# Altium schematic sheet POWER_SUPPLY_1.SchDoc: Power Supply
size A3; DocumentNumber: 8; SheetNumber: 8; SheetTotal: 12
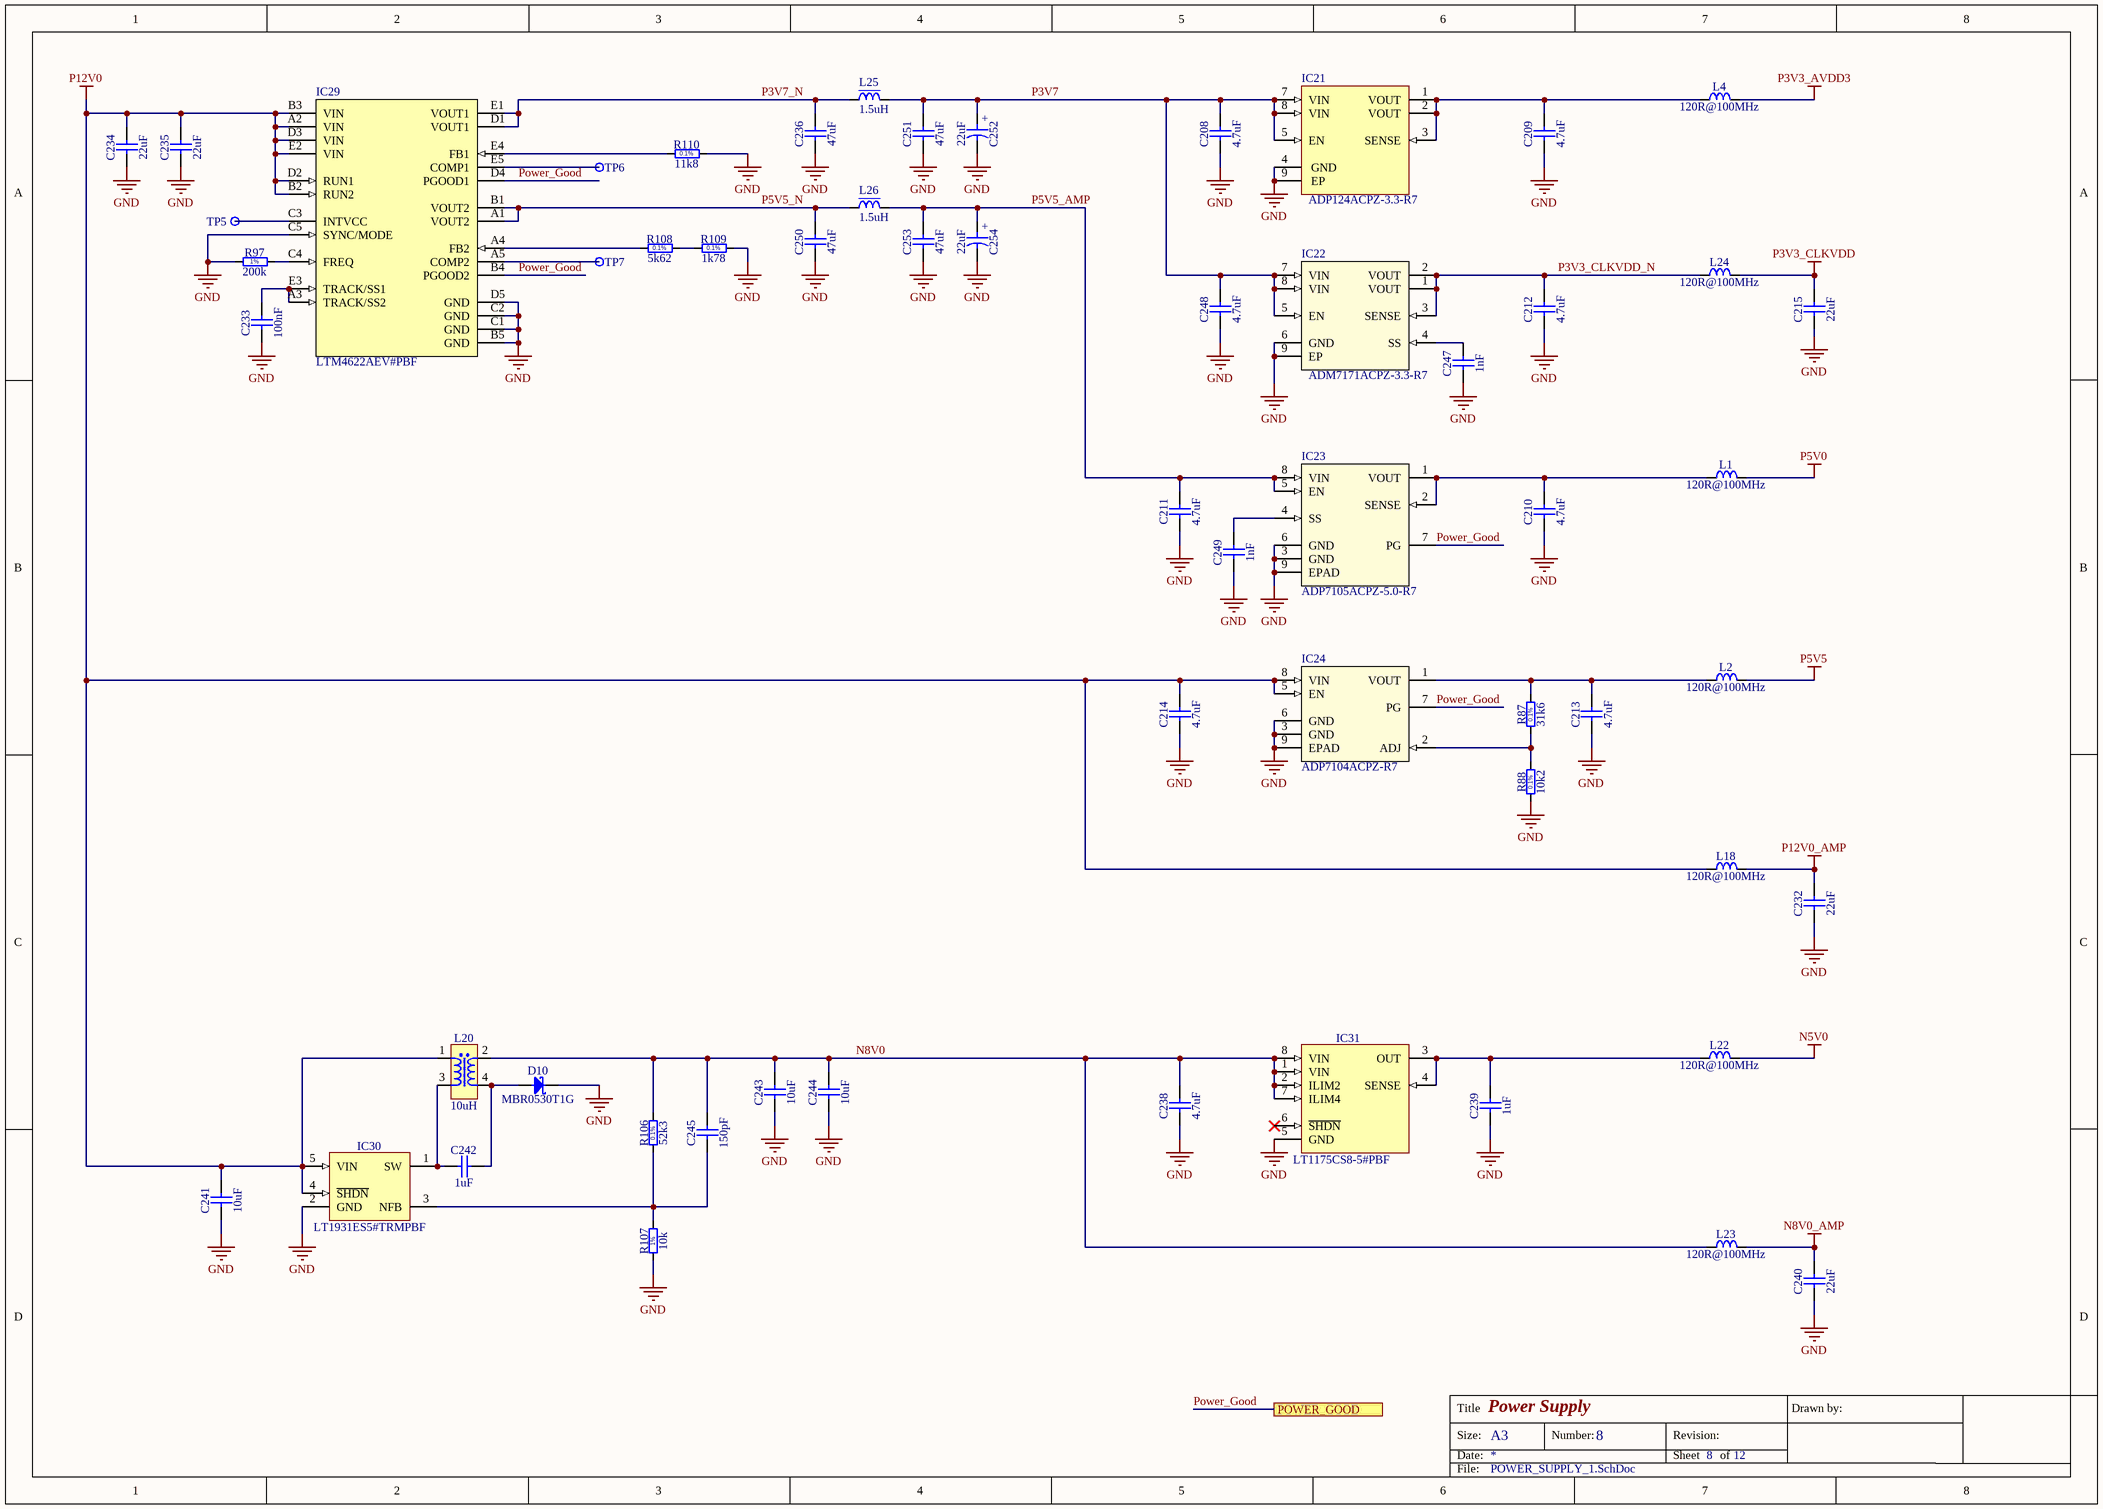
[diagram p0: POWER_SUPPLY_1.SchDoc]

## Parts
C208  4.7uF  [CAPC1709X95N]
C209  4.7uF  [CAPC1709X95N]
C210  4.7uF  [CAPC1709X95N]
C211  4.7uF  [CAPC1709X95N]
C212  4.7uF  [CAPC1709X95N]
C213  4.7uF  [CAPC1709X95N]
C214  4.7uF  [CAPC1709X95N]
C215  22uF  [CAPC1709X100N]
C232  22uF  [CAPC1709X100N]
C233  100nF  [CAPC1005X55N]
C234  22uF  [CAPC2012X135N]
C235  22uF  [CAPC2012X135N]
C236  47uF  [CAPC3225X270N]
C238  4.7uF  [CAPC1709X95N]
C239  1uF  [CAPC1608X87N]
C240  22uF  [CAPC1709X100N]
C241  10uF  [CAPC2012X135N]
C242  1uF  [CAPC1608X87N]
C243  10uF  [CAPC2012X135N]
C244  10uF  [CAPC2012X135N]
C245  150pF  [CAPC1005X55N]
C247  1nF  [CAPC0603X33N]
C248  4.7uF  [CAPC1709X95N]
C249  1nF  [CAPC0603X33N]
C250  47uF  [CAPC3225X270N]
C251  47uF  [CAPC3225X270N]
C252  22uF  [CAPMP3528X210N]
C253  47uF  [CAPC3225X270N]
C254  22uF  [CAPMP3528X210N]
D10  MBR0530T1G  [SOD3715X145N]
IC21  ADP124ACPZ-3.3-R7  [CP_8_8-L]
IC22  ADM7171ACPZ-3.3-R7  [CP_8_21-L]
IC23  ADP7105ACPZ-5.0-R7  [CP_8_5]
IC24  ADP7104ACPZ-R7  [CP_8_5]
IC29  LTM4622AEV#PBF  [LGA25C127P5X5_625X625X182]
IC30  LT1931ES5#TRMPBF  [SOT95P280X100-5N]
IC31  LT1175CS8-5#PBF  [SOIC127P600X175-8N]
L1  120R@100MHz  [INDC1608X65N]
L2  120R@100MHz  [INDC1608X65N]
L4  120R@100MHz  [INDC1608X65N]
L18  120R@100MHz  [INDC1608X65N]
L20  10uH  [IND_BOURNS_SRF0703]
L22  120R@100MHz  [INDC1608X65N]
L23  120R@100MHz  [INDC1608X65N]
L24  120R@100MHz  [INDC1608X65N]
L25  1.5uH  [IND_SPM4020]
L26  1.5uH  [IND_SPM4020]
R87  31k6  [RESC1608X55N]
R88  10k2  [RESC1608X55N]
R97  200k  [RESC1005X40N]
R106  52k3  [RESC1608X55N]
R107  10k  [RESC1608X55N]
R108  5k62  [RESC1608X55N]
R109  1k78  [RESC1608X55N]
R110  11k8  [RESC1608X55N]
TP5  Test Point  [TPS62]  (value not drawn)
TP6  Test Point  [TPS62]  (value not drawn)
TP7  Test Point  [TPS62]  (value not drawn)

## Ports
POWER_GOOD

## Nets
GND: C208.1 C209.1 C210.1 C211.1 C212.1 C213.1 C214.1 C215.1 C232.1 C233.1 C234.1 C235.1 C236.1 C238.1 C239.1 C240.1 C241.1 C243.1 C244.1 C247.1 C248.1 C249.1 C250.1 C251.1 C252.2 C253.1 C254.2 D10.1(C) IC21.4(GND) IC21.9(EP) IC22.6(GND) IC22.9(EP) IC23.3(GND) IC23.6(GND) IC23.9(EPAD) IC24.3(GND) IC24.6(GND) IC24.9(EPAD) IC29.B5(GND) IC29.C1(GND) IC29.C2(GND) IC29.C5(SYNC/MODE) IC29.D5(GND) IC30.2(GND) IC31.5(GND) R88.1 R97.1 R107.1 R109.2 R110.2
N5V0: L22.2
N8V0_AMP: C240.2 L23.2
P3V3_AVDD3: L4.2
P3V3_CLKVDD: C215.2 L24.2
P5V0: L1.2
P5V5: L2.2
P12V0: C214.2 C234.2 C235.2 C241.2 IC24.5(EN) IC24.8(VIN) IC29.A2(VIN) IC29.B2(RUN2) IC29.B3(VIN) IC29.D2(RUN1) IC29.D3(VIN) IC29.E2(VIN) IC30.4(~{SHDN}) IC30.5(VIN) L18.1 L20.1
P12V0_AMP: C232.2 L18.2
N8V0: C238.2 C243.2 C244.2 C245.2 IC31.1(VIN) IC31.2(ILIM2) IC31.7(ILIM4) IC31.8(VIN) L20.2 L23.1 R106.2
P3V3_CLKVDD_N: C212.2 IC22.1(VOUT) IC22.2(VOUT) IC22.3(SENSE) L24.1
P3V7: C208.2 C248.2 C251.2 C252.1 IC21.5(EN) IC21.7(VIN) IC21.8(VIN) IC22.5(EN) IC22.7(VIN) IC22.8(VIN) L25.2
P3V7_N: C236.2 IC29.D1(VOUT1) IC29.E1(VOUT1) L25.1
P5V5_AMP: C211.2 C253.2 C254.1 IC23.5(EN) IC23.8(VIN) L26.2
P5V5_N: C250.2 IC29.A1(VOUT2) IC29.B1(VOUT2) L26.1
Power_Good: IC23.7(PG) IC24.7(PG) IC29.B4(PGOOD2) IC29.D4(PGOOD1) ; port POWER_GOOD
NetC209_2: C209.2 IC21.1(VOUT) IC21.2(VOUT) IC21.3(SENSE) L4.1
NetC210_2: C210.2 IC23.1(VOUT) IC23.2(SENSE) L1.1
NetC213_2: C213.2 IC24.1(VOUT) L2.1 R87.2
NetC233_2: C233.2 IC29.A3(TRACK/SS2) IC29.E3(TRACK/SS1)
NetC239_2: C239.2 IC31.3(OUT) IC31.4(SENSE) L22.1
NetC242_1: C242.1 IC30.1(SW) L20.3
NetC242_2: C242.2 D10.2(A) L20.4
NetC245_1: C245.1 IC30.3(NFB) R106.1 R107.2
NetC247_2: C247.2 IC22.4(SS)
NetC249_2: C249.2 IC23.4(SS)
NetIC24_2: IC24.2(ADJ) R87.1 R88.2
NetIC29_A4: IC29.A4(FB2) R108.1
NetIC29_A5: IC29.A5(COMP2) TP7.1
NetIC29_C3: IC29.C3(INTVCC) TP5.1
NetIC29_C4: IC29.C4(FREQ) R97.2
NetIC29_E4: IC29.E4(FB1) R110.1
NetIC29_E5: IC29.E5(COMP1) TP6.1
NetR108_2: R108.2 R109.1

Not connected (* = marked no-connect by the designer): IC21 6(NC); IC24 4(NC); IC31 6(~{SHDN})*

## Notes on the sheet
- Title
- Size:
- Date:
- A3
- Number:
- Revision:
- Sheet
- of
- Drawn by:
- File:
- (in symbol CTE3528-21_22UF_10V_10%_LESR0700) +
- (in symbol R0402_200K_1%_0.0625W_100PPM) 1%
- (in symbol R0603_1K78_0.1%_0.063W_10PPM) 0.1%
- (in symbol R0603_5K62_0.1%_0.063W_10PPM) 0.1%
- (in symbol R0603_10K2_0.1%_0.063W_10PPM) 0.1%
- (in symbol R0603_10K_1%_0.1W_100PPM) 1%
- (in symbol R0603_11K8_0.1%_0.063W_10PPM) 0.1%
- (in symbol R0603_31K6_0.1%_0.063W_10PPM) 0.1%
- (in symbol R0603_52K3_0.1%_0.063W_10PPM) 0.1%

## Library data of the parts
C208-C214 C238 C248 = CC0603_4.7UF_16V_10%_X5R: Non-polarised capacitor; Part Description: SMD Multilayer Chip Ceramic Capacitor; Manufacturer: GENERIC; Manufacturer1 Part Number: EMK107ABJ475KA-T; Voltage: 16V; TC: X5R; Tolerance: ±10%; Part Number: CC0603_4.7UF_16V_10%_X5R; Component Kind: Standard; Component Type: Standard; Pin Count: 2; Value: 4.7uF; Status: None; Manufacturer Part Number: CC0603_4.7UF_16V_10%_X5R; Case: 0603; Mounted: Yes; Socket: No; SMD: Yes; Sense: No; Manufacturer1 Example: TAIYO YUDEN; Manufacturer1 ComponentHeight: 0.95mm; HelpURL: \\cern.ch\dfs\Applications\Altium\Datasheets\CC0603_X7R_TAIYO-YUDEN_HIGH-VALUE.pdf; Author: CERN DEM JLC; CreateDate: 16.12.2013; LatestRevisionDate: 16.09.2014
C215 C232 C240 = CC0603_22UF_6.3V_20%_X5R: Non-polarised capacitor; Part Description: SMD Multilayer Chip Ceramic Capacitor; Manufacturer: GENERIC; Manufacturer1 Part Number: C1608X5R0J226M080AC; Voltage: 6.3V; TC: X5R; Tolerance: ±20%; Part Number: CC0603_22UF_6.3V_20%_X5R; Component Kind: Standard; Component Type: Standard; Pin Count: 2; Value: 22uF; Status: None; Manufacturer Part Number: CC0603_22UF_6.3V_20%_X5R; Case: 0603; Mounted: Yes; Socket: No; SMD: Yes; Sense: No; Manufacturer1 Example: TDK; Manufacturer1 ComponentHeight: 1mm; HelpURL: \\cern.ch\dfs\Applications\Altium\Datasheets\CC0603_X5R_TDK_C.pdf; Author: CERN DEM JLC; CreateDate: 16.12.2013; LatestRevisionDate: 13.09.2016
C233 = CC0402_100NF_16V_10%_X5R: Non-polarised capacitor; Part Description: SMD Multilayer Chip Ceramic Capacitor; Manufacturer: GENERIC; Manufacturer1 Part Number: GRM155R61C104KA88D; Voltage: 16V; TC: X5R; Tolerance: ±10%; Part Number: CC0402_100NF_16V_10%_X5R; Component Kind: Standard; Component Type: Standard; Pin Count: 2; Value: 100nF; Status: None; Manufacturer Part Number: CC0402_100NF_16V_10%_X5R; Case: 0402; Mounted: Yes; Socket: No; SMD: Yes; Sense: No; Manufacturer1 Example: MURATA; Manufacturer1 ComponentHeight: 0.55mm; HelpURL: \\cern.ch\dfs\Applications\Altium\Datasheets\CC0402_X5R_MURATA_GRM.pdf; Author: CERN DEM JLC; CreateDate: 10.12.2013; LatestRevisionDate: 10.12.2013
C234 C235 = CC0805_22UF_16V_10%_X5R: Non-polarised capacitor; Part Description: SMD Multilayer Chip Ceramic Capacitor; Manufacturer: GENERIC; Manufacturer1 Part Number: C2012X5R1C226KT; Voltage: 16V; TC: X5R; Tolerance: ±10%; Part Number: CC0805_22UF_16V_10%_X5R; Component Kind: Standard; Component Type: Standard; Pin Count: 2; Value: 22uF; Status: Preferred; Manufacturer Part Number: CC0805_22UF_16V_10%_X5R; Case: 0805; Mounted: Yes; Socket: No; SMD: Yes; Sense: No; Manufacturer1 Example: TDK; Manufacturer1 ComponentHeight: 1.35mm; HelpURL: \\cern.ch\dfs\Applications\Altium\Datasheets\CC0805_X5R_TDK_C.pdf; Author: CERN DEM JLC; CreateDate: 25.10.2012; LatestRevisionDate: 25.10.2012
C236 C250 C251 C253 = CC1210_47UF_10V_20%_X5R: Non-polarised capacitor; Part Description: SMD Multilayer Chip Ceramic Capacitor; Manufacturer: GENERIC; Manufacturer1 Part Number: LMK325BJ476MM-T; Voltage: 10V; TC: X5R; Tolerance: ±20%; Part Number: CC1210_47UF_10V_20%_X5R; Component Kind: Standard; Component Type: Standard; Pin Count: 2; Value: 47uF; Status: None; Manufacturer Part Number: CC1210_47UF_10V_20%_X5R; Case: 1210; Mounted: Yes; Socket: No; SMD: Yes; Sense: No; Manufacturer1 Example: TAIYO YUDEN; Manufacturer1 ComponentHeight: 2.7mm; HelpURL: \\cern.ch\dfs\Applications\Altium\Datasheets\CC1210_X5R_TAIYO-YUDEN_HIGH-VALUE.pdf; Author: CERN DEM JLC; CreateDate: 04.05.2011; LatestRevisionDate: 04.05.2011
C239 = CC0603_1UF_16V_10%_X7R: Non-polarised capacitor; Part Description: SMD Multilayer Chip Ceramic Capacitor; Manufacturer: GENERIC; Manufacturer1 Part Number: 223878615663; Voltage: 16V; TC: X7R; Tolerance: ±10%; Part Number: CC0603_1UF_16V_10%_X7R; Component Kind: Standard; Component Type: Standard; Pin Count: 2; Value: 1uF; Status: None; Manufacturer Part Number: CC0603_1uF_16V_10%_X7R; Case: 0603; Mounted: Yes; Socket: No; SMD: Yes; Sense: No; Manufacturer1 Example: YAGEO PHYCOMP; Manufacturer1 ComponentHeight: 0.9mm; HelpURL: \\cern.ch\dfs\Applications\Altium\Datasheets\CC0603_X7R_PHYCOMP.pdf; Author: CERN DEM JLC; CreateDate: 03.12.2007; LatestRevisionDate: 17.04.2015
C241 C243 C244 = CC0805_10UF_16V_10%_X5R: Non-polarised capacitor; Part Description: SMD Multilayer Chip Ceramic Capacitor; Manufacturer: GENERIC; Manufacturer1 Part Number: C0805C106K4PAC; Voltage: 16V; TC: X5R; Tolerance: ±10%; Part Number: CC0805_10UF_16V_10%_X5R; Component Kind: Standard; Component Type: Standard; Pin Count: 2; Value: 10uF; Status: Preferred; Manufacturer Part Number: CC0805_10UF_16V_10%_X5R; Case: 0805; Mounted: Yes; Socket: No; SMD: Yes; Sense: No; Manufacturer1 Example: KEMET; Manufacturer1 ComponentHeight: 1.4mm; HelpURL: \\cern.ch\dfs\Applications\Altium\Datasheets\CC1206_X5R_KEMET.pdf; Author: CERN DEM JLC; CreateDate: 03.12.2007; LatestRevisionDate: 03.12.2007
C242 = CC0603_1UF_25V_10%_X7R: Non-polarised capacitor; Part Description: SMD Multilayer Chip Ceramic Capacitor; Manufacturer: GENERIC; Manufacturer1 Part Number: GRM188R71E105KA12D; Voltage: 25V; TC: X7R; Tolerance: ±10%; Part Number: CC0603_1UF_25V_10%_X7R; Component Kind: Standard; Component Type: Standard; Pin Count: 2; Value: 1uF; Status: None; Manufacturer Part Number: CC0603_1UF_25V_10%_X7R; Case: 0603; Mounted: Yes; Socket: No; SMD: Yes; Sense: No; Manufacturer1 Example: MURATA; Manufacturer1 ComponentHeight: 0.9mm; HelpURL: \\cern.ch\dfs\Applications\Altium\Datasheets\CC0603_X7R_MURATA.pdf; Author: CERN DEM JLC; CreateDate: 18.01.2011; LatestRevisionDate: 18.01.2011
C245 = CC0402_150PF_50V_5%_C0G: Non-polarised capacitor; Part Description: SMD Multilayer Chip Ceramic Capacitor; Manufacturer: GENERIC; Manufacturer1 Part Number: C0402C151J5GACTU; Voltage: 50V; TC: C0G/NP0; Tolerance: ±5%; Part Number: CC0402_150PF_50V_5%_C0G; Component Kind: Standard; Component Type: Standard; Pin Count: 2; Value: 150pF; Status: Preferred; Manufacturer Part Number: CC0402_150PF_50V_5%_C0G; Case: 0402; Mounted: Yes; Socket: No; SMD: Yes; Sense: No; Manufacturer1 Example: KEMET; Manufacturer1 ComponentHeight: 0.55mm; HelpURL: \\cern.ch\dfs\Applications\Altium\Datasheets\CC0805_C0G_KEMET_(Commercial Grade).pdf; Author: CERN DEM JLC; CreateDate: 03.12.2007; LatestRevisionDate: 22.04.2015
C247 C249 = CC0201_1NF_16V_10%_X5R: Non-polarised capacitor; Part Description: SMD Multilayer Chip Ceramic Capacitor; Manufacturer: GENERIC; Manufacturer1 Part Number: 0201YD102KAT2A; Voltage: 16V; TC: X5R; Tolerance: ±10%; Part Number: CC0201_1NF_16V_10%_X5R; Component Kind: Standard; Component Type: Standard; Pin Count: 2; Value: 1nF; Status: Not Recommended; Manufacturer Part Number: CC0201_1NF_16V_10%_X5R; Case: 0201; Mounted: Yes; Socket: No; SMD: Yes; Sense: No; Manufacturer1 Example: AVX; Manufacturer1 ComponentHeight: 0.33mm; HelpURL: \\cern.ch\dfs\Applications\Altium\Datasheets\CC0201_X5R_AVX.pdf; Author: CERN DEM JLC; CreateDate: 03.12.2007; LatestRevisionDate: 03.12.2007
C252 C254 = CTE3528-21_22UF_10V_10%_LESR0700: Polarised capacitor; Part Description: Low ESR 0R7 Solid Tantalum Chip Capacitor; Manufacturer: GENERIC; Manufacturer1 Part Number: TPSB226K010R0700; Voltage: 10V; Tolerance: ±10%; Part Number: CTE3528-21_22UF_10V_10%_LESR0700; Component Kind: Standard; Component Type: Standard; Pin Count: 2; Value: 22uF; Status: Preferred; Manufacturer Part Number: CTE3528-21_22UF_10V_10%_LESR0700; Case: B; Mounted: Yes; Socket: No; SMD: Yes; Sense: No; Manufacturer1 Example: AVX; Manufacturer1 ComponentHeight: 2.1mm; HelpURL: \\cern.ch\dfs\Applications\Altium\Datasheets\CTE-LESR_AVX_TPS.pdf; Author: CERN DEM JLC; CreateDate: 05.05.2008; LatestRevisionDate: 20.01.2009
D10 = MBR0530T1G: Schottky Diode; Part Description: Schottky Power Rectifier; Manufacturer: ON SEMICONDUCTOR; Voltage: 30V; Power: 500mA; PressFit: No; Bonding: No; Part Number: MBR0530T1G; Component Kind: Standard; Component Type: Standard; Device: MBR0530T1G; PackageDescription: SOD Diode (SOD-123); 2.70mm W X 1.55mm L X 1.45mm H body, IPC Medium Density; Manufacturer Part Number: MBR0530T1G; Pin Count: 2; Case: SOD-123; Mounted: Yes; Socket: No; SMD: Yes; Sense: No; ComponentHeight: 1.45mm; HelpURL: \\cern.ch\dfs\Applications\Altium\Datasheets\MBR0530T1G.pdf; Author: CERN DEM JLC; CreateDate: 21.07.2010; LatestRevisionDate: 21.07.2010
IC21 = ADP124ACPZ-3.3-R7: 500 mA, Low Quiescent Current, CMOS Linear Regulator, 2.3 to 5.5 V Vin, 3.3 V Vout, Industrial, 8-pin SON (CP-8-8), Reel; Manufacturer: Analog Devices; Iout max: 500mA; Preset Vout Values (V): 3.3; Supply Current IGND @ Small Load: 45uA; Vin (min) (V): 2.3; Vin (max) (V): 5.5; Mounting Technology: Surface Mount; ComponentLink3URL: http:/www.analog.com/static/imported-files/packages/PKG_PDF/LFCSP(CP)/CP_8_8.pdf; ComponentLink1Description: Manufacturer URL; ComponentLink2Description: Datasheet; ComponentLink4URL: Product URL:http://www.analog.com/en/ADP124/productSearch.html; ComponentLink1URL: http://www.analog.com/en/index.html; PackageReference: CP-8-8; ComponentLink2URL: http://www.analog.com/static/imported-files/data_sheets/ADP124_125.pdf; ComponentLink4Description: URL Link1; PackageDescription: 8-Pin Lead Frame Chip Scale Package, Body 2 x 2 mm, Pitch 0.5 mm; ComponentLink3Description: Package Specification; Manufacturer Part Number: ADP124ACPZ-3.3-R7
IC22 = ADM7171ACPZ-3.3-R7: 6.5 V, 1 A, Ultralow Noise, High PSRR,  Fast Transient Response CMOS LDO; Manufacturer: Analog Devices; Value: Value; Type: Type; Manufacturer Part Number: ADM7171ACPZ-3.3-R7
IC23 = ADP7105ACPZ-5.0-R7: 20 V, 500 mA, Low Noise LDO Regulator  with Soft Start; Manufacturer: Analog Devices; Value: Value; Type: Type; Manufacturer Part Number: ADP7105ACPZ-5.0-R7
IC24 = ADP7104ACPZ-R7: 20 V, 500 mA, Low Noise CMOS LDO; Manufacturer: Analog Devices; Value: Value; Type: Type; Manufacturer Part Number: ADP7104ACPZ-R7
IC29 = LTM4622IV#PBF: Dual Ultrathin 2A or Single 4A, 3.6V to 20V, 1.5V to 12V   Step-Down DC/DC µModule Regulator; Manufacturer: LINEAR TECHNOLOGY; Manufacturer Part Number: LTM4622AEV#PBF
IC30 = LT1931ES5#TRMPBF: 1.2MHz/2.2MHz Inverting DC/DC Converters in ThinSOT; Part Description: +16V to (-0.4V to -36V), 1.2MHz Inverting DC-DC Converters; Manufacturer: LINEAR TECHNOLOGY; PressFit: No; Bonding: No; Part Number: LT1931ES5#TRMPBF; Component Kind: Standard; Component Type: Standard; Device: LT1931ES5#TRMPBF; PackageDescription: SOT23, 0.95mm pitch; 5 pin, 1.6mm W X 2.9mm L, IPC Medium Density; Manufacturer Part Number: LT1931ES5#TRMPBF; Pin Count: 5; Case: SOT23; Mounted: Yes; Socket: No; SMD: Yes; Sense: No; ComponentHeight: 1mm; HelpURL: \\cern.ch\dfs\Applications\Altium\Datasheets\LT1931ES5#TRMPBF.pdf; Author: CERN DEM JLC; CreateDate: 18.01.2010; LatestRevisionDate: 18.04.2012
IC31 = LT1175CS8#PBF: 5V 500mA Negative Low Dropout Micropower Regulator; Manufacturer: LINEAR TECHNOLOGY; Table: Regulators; Part Number: LT1175CS8#PBF; Component Kind: Standard; Component Type: Standard; Device: LT1175CS8-5#PBF; PackageDescription: SOIC 8, Pitch 1.27mm - Body 4x5mm, IPC Medium Density; Part Description: 5V 500mA Negative Low Dropout Micropower Regulator; Manufacturer Part Number: LT1175CS8-5#PBF; Pin Count: 8; Case: SOIC8; Mounted: Yes; Socket: No; SMD: Yes; ComponentHeight: 1.75mm; HelpURL: \\cern.ch\dfs\Applications\Altium\Datasheets\LT1175CS8#PBF.pdf; Author: CERN DEM JLC; CreateDate: 18.01.2010; LatestRevisionDate: 18.01.2010
L1 L2 L4 L18 L22-L24 = IND0603_MURATA_BLM18SG121TN1D: Inductor; Part Description: SMD EMIFIL Suppression Chip Ferrite Bead; Manufacturer: MURATA; Power: 3A; Resistance: 0.025R; Tolerance: ±25%; Part Number: IND0603_MURATA_BLM18SG121TN1D; Component Kind: Standard; Component Type: Standard; Pin Count: 2; Value: 120R@100MHz; Status: None; Manufacturer Part Number: BLM18SG121TN1D; Case: 0603; Mounted: Yes; Socket: No; SMD: Yes; Sense: No; ComponentHeight: 0.65mm; HelpURL: \\cern.ch\dfs\Applications\Altium\Datasheets\IND0603_MURATA_BLM18S.pdf; Author: CERN DEM JLC; CreateDate: 23.07.2014; LatestRevisionDate: 23.07.2014
L20 = IND_10UH_20%_BOURNS_SRF0703: Dual-Winding Shielded Power Inductor SRF0703 Serie; Manufacturer: BOURNS; Manufacturer Part Number: SRF0703-100M; Power: 2.08A; Resistance: 0.0826R; Tolerance: ±20%; Part Number: IND_10UH_20%_BOURNS_SRF0703; Component Kind: Standard; Component Type: Standard; Pin Count: 2; Value: 10uH; Status: None; Part Description: Dual-Winding Shielded Power Inductor; Mounted: Yes; Socket: No; SMD: Yes; Sense: No; ComponentHeight: 3.6mm; HelpURL: \\cern.ch\dfs\Applications\Altium\Datasheets\IND_BOURNS_SRF0703.pdf; Author: CERN DEM JLC; CreateDate: 26.03.2013; LatestRevisionDate: 26.03.2013
L25 L26 = IND_1.5UH_20%_TDK_SPM4020-LR: Inductor With Core; Part Description: SMD Inductor for Power Circuits (Wound Metal), SPM Series; Manufacturer: TDK; Manufacturer Part Number: SPM4020T-1R5M-LR; Power: 6.3A; Resistance: 0.0399R; Tolerance: ±20%; Part Number: IND_1.5UH_20%_TDK_SPM4020-LR; Component Kind: Standard; Component Type: Standard; Footprint: IND_TDK_SPM4020-LR; Pin Count: 2; Value: 1.5uH; Status: None; Mounted: Yes; Socket: No; SMD: Yes; Sense: No; ComponentHeight: 3mm; HelpURL: \\cern.ch\dfs\Applications\Altium\Datasheets\IND_TDK_SPM6530.pdf; Author: CERN DEM MR; CreateDate: 08.11.2016; LatestRevisionDate: 08.11.2016
R87 = R0603_31K6_0.1%_0.063W_10PPM: Resistor - 0.1%; Part Description: Thin Film Chip Resistor; Manufacturer: GENERIC; Manufacturer1 Part Number: RN73C1J31K6BTDF; Power: 0.063W; TC: ±10ppm; Part Number: R0603_31K6_0.1%_0.063W_10PPM; Component Kind: Standard; Component Type: Standard; Pin Count: 2; Value: 31k6; Status: Not recommended; Tolerance: ±0.1%; Manufacturer Part Number: R0603_31K6_0.1%_0.063W_10PPM; Case: 0603; Mounted: Yes; Sense: No; Socket: No; SMD: Yes; Manufacturer1 Example: TYCO HOLSWORTHY; Manufacturer1 ComponentHeight: 0.5mm; HelpURL: \\cern.ch\dfs\Applications\Altium\Datasheets\R0603_Tyco_RN73.pdf; Author: CERN DEM JLC; CreateDate: 03.12.2007; LatestRevisionDate: 13.03.2008
R88 = R0603_10K2_0.1%_0.063W_10PPM: Resistor - 0.1%; Part Description: Thin Film Chip Resistor; Manufacturer: GENERIC; Manufacturer1 Part Number: RN73C1J10K2BTDF; Power: 0.063W; TC: ±10ppm; Part Number: R0603_10K2_0.1%_0.063W_10PPM; Component Kind: Standard; Component Type: Standard; Pin Count: 2; Value: 10k2; Status: Not recommended; Tolerance: ±0.1%; Manufacturer Part Number: R0603_10K2_0.1%_0.063W_10PPM; Case: 0603; Mounted: Yes; Sense: No; Socket: No; SMD: Yes; Manufacturer1 Example: TYCO HOLSWORTHY; Manufacturer1 ComponentHeight: 0.5mm; HelpURL: \\cern.ch\dfs\Applications\Altium\Datasheets\R0603_Tyco_RN73.pdf; Author: CERN DEM JLC; CreateDate: 03.12.2007; LatestRevisionDate: 13.03.2008
R97 = R0402_200K_1%_0.0625W_100PPM: Resistor - 1%; Part Description: General Purpose Thick Film Chip Resistor; Manufacturer: GENERIC; Manufacturer1 Part Number: 232270672004L; TC: ±100ppm/°C; Part Number: R0402_200K_1%_0.0625W_100PPM; Component Kind: Standard; Component Type: Standard; Pin Count: 2; Value: 200k; Status: Not recommended; Power: 0.0625W; Tolerance: ±1%; Manufacturer Part Number: R0402_200K_1%_0.0625W_100PPM; Case: 0402; Mounted: Yes; Sense: No; Socket: No; SMD: Yes; Manufacturer1 Example: YAGEO PHYCOMP; Manufacturer1 ComponentHeight: 0.4mm; HelpURL: \\cern.ch\dfs\Applications\Altium\Datasheets\R0402_Phycomp_RC0402.pdf; Author: CERN DEM JLC; CreateDate: 03.12.2007; LatestRevisionDate: 17.10.2012
R106 = R0603_52K3_0.1%_0.063W_10PPM: Resistor - 0.1%; Part Description: Thin Film Chip Resistor; Manufacturer: GENERIC; Manufacturer1 Part Number: RN73C1J52K3BTDF; Power: 0.063W; TC: ±10ppm; Part Number: R0603_52K3_0.1%_0.063W_10PPM; Component Kind: Standard; Component Type: Standard; Pin Count: 2; Value: 52k3; Status: Not recommended; Tolerance: ±0.1%; Manufacturer Part Number: R0603_52K3_0.1%_0.063W_10PPM; Case: 0603; Mounted: Yes; Sense: No; Socket: No; SMD: Yes; Manufacturer1 Example: TYCO HOLSWORTHY; Manufacturer1 ComponentHeight: 0.5mm; HelpURL: \\cern.ch\dfs\Applications\Altium\Datasheets\R0603_Tyco_RN73.pdf; Author: CERN DEM JLC; CreateDate: 03.12.2007; LatestRevisionDate: 13.03.2008
R107 = R0603_10K_1%_0.1W_100PPM: Resistor - 1%; Part Description: General Purpose Thick Film Chip Resistor; Manufacturer: GENERIC; Manufacturer1 Part Number: NRC06F1002TRF; Power: 0.1W; TC: ±100ppm/°C; Part Number: R0603_10K_1%_0.1W_100PPM; Component Kind: Standard; Component Type: Standard; Pin Count: 2; Value: 10k; Status: Preferred; Tolerance: ±1%; Manufacturer Part Number: R0603_10K_1%_0.1W_100PPM; Case: 0603; Mounted: Yes; Sense: No; Socket: No; SMD: Yes; Manufacturer1 Example: NIC COMPONENT; Manufacturer1 ComponentHeight: 0.55mm; HelpURL: \\cern.ch\dfs\Applications\Altium\Datasheets\R0603_NIC_NRC.pdf; Author: CERN DEM JLC; CreateDate: 03.12.2007; LatestRevisionDate: 13.03.2008
R108 = R0603_5K62_0.1%_0.063W_10PPM: Resistor - 0.1%; Part Description: Thin Film Chip Resistor; Manufacturer: GENERIC; Manufacturer1 Part Number: RN73C1J5K62BTDF; Power: 0.063W; TC: ±10ppm; Part Number: R0603_5K62_0.1%_0.063W_10PPM; Component Kind: Standard; Component Type: Standard; Pin Count: 2; Value: 5k62; Status: Not recommended; Tolerance: ±0.1%; Manufacturer Part Number: R0603_5K62_0.1%_0.063W_10PPM; Case: 0603; Mounted: Yes; Sense: No; Socket: No; SMD: Yes; Manufacturer1 Example: TYCO HOLSWORTHY; Manufacturer1 ComponentHeight: 0.5mm; HelpURL: \\cern.ch\dfs\Applications\Altium\Datasheets\R0603_Tyco_RN73.pdf; Author: CERN DEM JLC; CreateDate: 03.12.2007; LatestRevisionDate: 13.03.2008
R109 = R0603_1K78_0.1%_0.063W_10PPM: Resistor - 0.1%; Part Description: Thin Film Chip Resistor; Manufacturer: GENERIC; Manufacturer1 Part Number: RN73C1J1K78BTDF; Power: 0.063W; TC: ±10ppm; Part Number: R0603_1K78_0.1%_0.063W_10PPM; Component Kind: Standard; Component Type: Standard; Pin Count: 2; Value: 1k78; Status: Not recommended; Tolerance: ±0.1%; Manufacturer Part Number: R0603_1K78_0.1%_0.063W_10PPM; Case: 0603; Mounted: Yes; Sense: No; Socket: No; SMD: Yes; Manufacturer1 Example: TYCO HOLSWORTHY; Manufacturer1 ComponentHeight: 0.5mm; HelpURL: \\cern.ch\dfs\Applications\Altium\Datasheets\R0603_Tyco_RN73.pdf; Author: CERN DEM JLC; CreateDate: 03.12.2007; LatestRevisionDate: 13.03.2008
R110 = R0603_11K8_0.1%_0.063W_10PPM: Resistor - 0.1%; Part Description: Thin Film Chip Resistor; Manufacturer: GENERIC; Manufacturer1 Part Number: RN73C1J11K8BTDF; Power: 0.063W; TC: ±10ppm; Part Number: R0603_11K8_0.1%_0.063W_10PPM; Component Kind: Standard; Component Type: Standard; Pin Count: 2; Value: 11k8; Status: Not recommended; Tolerance: ±0.1%; Manufacturer Part Number: R0603_11K8_0.1%_0.063W_10PPM; Case: 0603; Mounted: Yes; Sense: No; Socket: No; SMD: Yes; Manufacturer1 Example: TYCO HOLSWORTHY; Manufacturer1 ComponentHeight: 0.5mm; HelpURL: \\cern.ch\dfs\Applications\Altium\Datasheets\R0603_Tyco_RN73.pdf; Author: CERN DEM JLC; CreateDate: 03.12.2007; LatestRevisionDate: 13.03.2008
TP5-TP7 = SMD_PAD_0.62X0.62MM: Part Description: 0.62mm x 0.62mm PCB Copper Area (SMD Test Point); Mounted: No; Part Number: SMD_PAD_0.62X0.62MM; Component Kind: Standard (No BOM); Component Type: Standard (No BOM); Pin Count: 1; Family: Test Point; Socket: No; SMD: Yes; Sense: No; Status: None; ComponentHeight: 0mm; HelpURL: Undefined; Author: CERN DEM JLC; CreateDate: 12.01.2008; LatestRevisionDate: 12.01.2008; PackageDescription: 0.62mm x 0.62mm PCB Copper Area (SMD Test Point)